# EAGLE design rev_B (EAGLE 9.5.0)
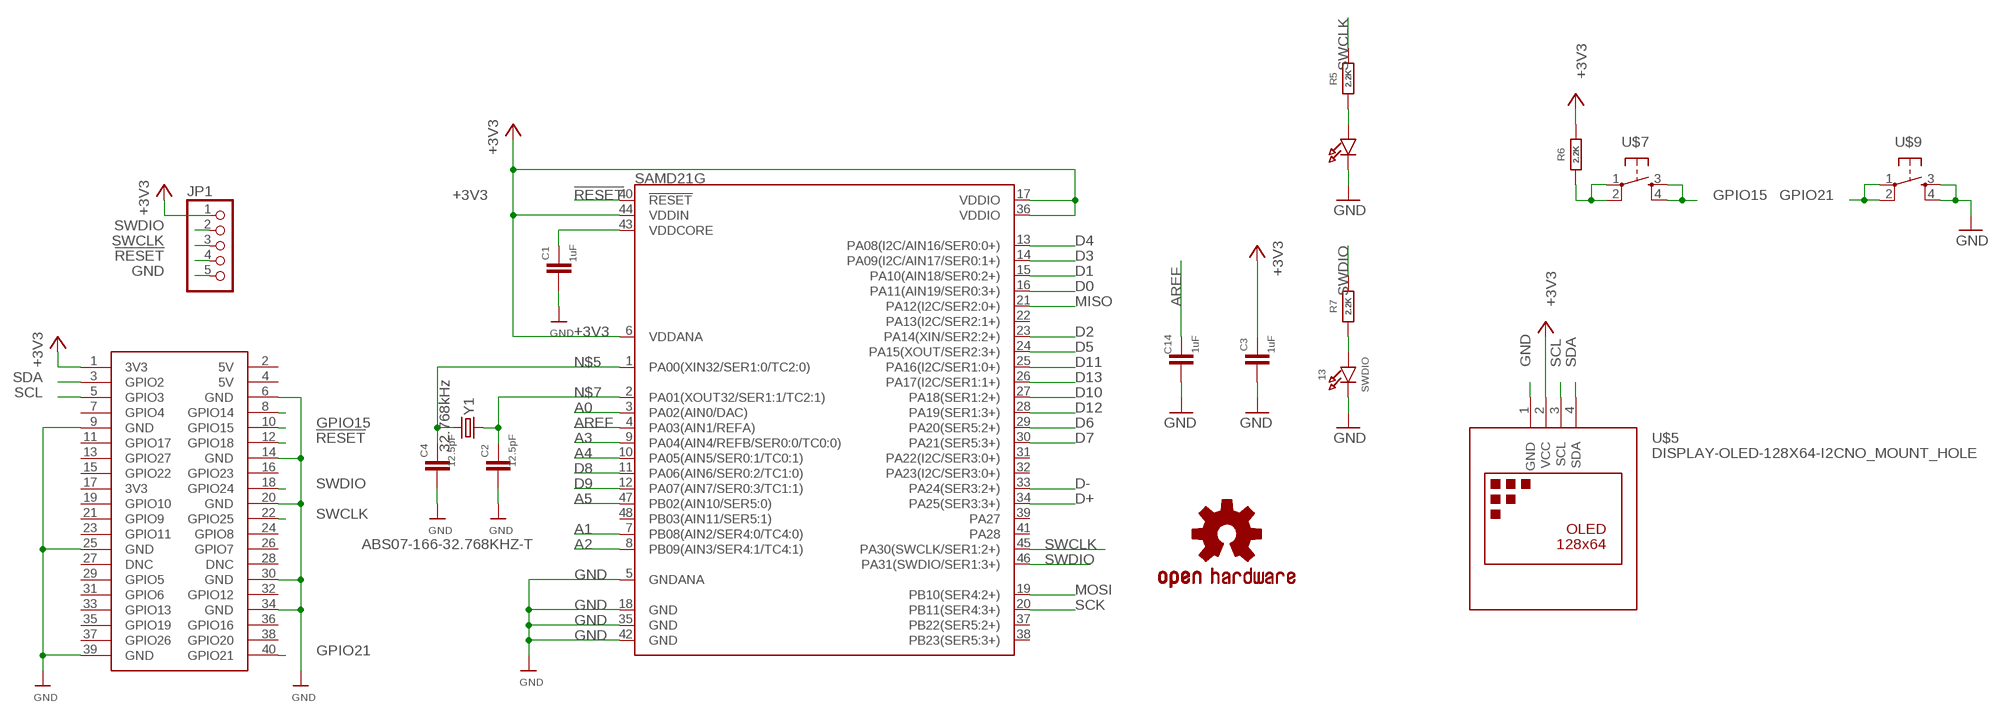
[diagram p0: schematic, sheet 1]

## Parts
5  SWCLK  LED0805_NOOUTLINE  [CHIPLED_0805_NOOUTLINE]
13  SWDIO  LED0805_NOOUTLINE  [CHIPLED_0805_NOOUTLINE]
C1  1uF  C-EUC0805  [C0805]
C2  12.5pF  C-EUC0805  [C0805]
C3  1uF  C-EUC0805  [C0805]
C4  12.5pF  C-EUC0805  [C0805]
C14  1uF  C-EUC0805  [C0805]
JP1  PINHD-1X5  [1X05]
LOGO1  OSHW-LOGOS  [OSHW-LOGO-S]
R5  2.2K  R-EU_R0805  [R0805]
R6  2.2K  R-EU_R0805  [R0805]
R7  2.2K  R-EU_R0805  [R0805]
SAMD21G  ATSAMD21G-A  [TQFP-48]
U$1  RASPBERRY_PI_ZERO  [RASPBERRY_PI_ZERO]
U$5  DISPLAY-OLED-128X64-I2CNO_MOUNT_HOLE  [DISPLAY-OLED-128X64-I2C]
U$7  TACTILE_SWITCH_LONG_THT_  [TACTILE_SWICTH_THT]
U$9  TACTILE_SWITCH_LONG_THT_  [TACTILE_SWICTH_THT]
Y1  32.768kHz  CRYSTAL3.2X1.5MM  [CRYSTAL-SMD-3.2X1.5MM]

## Nets
!RESET: JP1.4 SAMD21G.40(!RESET!) U$1.12(GPIO18)
+3V3: C3.1 JP1.1 R6.1 SAMD21G.6(VDDANA) SAMD21G.17(VDDIO) SAMD21G.36(VDDIO) SAMD21G.44(VDDIN) U$1.1(3V3) U$5.2(VCC)
A0: SAMD21G.3(PA02(AIN0/DAC))
A1: SAMD21G.7(PB08(AIN2/SER4:0/TC4:0))
A2: SAMD21G.8(PB09(AIN3/SER4:1/TC4:1))
A3: SAMD21G.9(PA04(AIN4/REFB/SER0:0/TC0:0))
A4: SAMD21G.10(PA05(AIN5/SER0:1/TC0:1))
A5: SAMD21G.47(PB02(AIN10/SER5:0))
AREF: C14.1 SAMD21G.4(PA03(AIN1/REFA))
D0: SAMD21G.16(PA11(AIN19/SER0:3+))
D1: SAMD21G.15(PA10(AIN18/SER0:2+))
D2: SAMD21G.23(PA14(XIN/SER2:2+))
D3: SAMD21G.14(PA09(I2C/AIN17/SER0:1+))
D4: SAMD21G.13(PA08(I2C/AIN16/SER0:0+))
D5: SAMD21G.24(PA15(XOUT/SER2:3+))
D6: SAMD21G.29(PA20(SER5:2+))
D7: SAMD21G.30(PA21(SER5:3+))
D8: SAMD21G.11(PA06(AIN6/SER0:2/TC1:0))
D9: SAMD21G.12(PA07(AIN7/SER0:3/TC1:1))
D10: SAMD21G.27(PA18(SER1:2+))
D11: SAMD21G.25(PA16(I2C/SER1:0+))
D12: SAMD21G.28(PA19(SER1:3+))
D13: SAMD21G.26(PA17(I2C/SER1:1+))
D+: SAMD21G.34(PA25(SER3:3+))
D-: SAMD21G.33(PA24(SER3:2+))
GND: 5.C 13.C C1.2 C2.2 C3.2 C4.2 C14.2 JP1.5 SAMD21G.5(GNDANA) SAMD21G.18(GND) SAMD21G.35(GND) SAMD21G.42(GND) U$1.6(GND) U$1.9(GND) U$1.14(GND) U$1.20(GND) U$1.25(GND) U$1.30(GND) U$1.34(GND) U$1.39(GND) U$5.1(GND) U$9.3 U$9.4
GPIO15: U$1.10(GPIO15) U$7.3 U$7.4
GPIO21: U$1.40(GPIO21) U$9.1 U$9.2
MISO: SAMD21G.21(PA12(I2C/SER2:0+))
MOSI: SAMD21G.19(PB10(SER4:2+))
N$2: 13.A R7.2
N$5: C4.1 SAMD21G.1(PA00(XIN32/SER1:0/TC2:0)) Y1.P$2
N$6: 5.A R5.2
N$7: C2.1 SAMD21G.2(PA01(XOUT32/SER1:1/TC2:1)) Y1.P$1
N$9: R6.2 U$7.1 U$7.2
N$16: U$1.8(GPIO14)
SCK: SAMD21G.20(PB11(SER4:3+))
SCL: U$1.5(GPIO3) U$5.3(SCL)
SDA: U$1.3(GPIO2) U$5.4(SDA)
SWCLK: JP1.3 R5.1 SAMD21G.45(PA30(SWCLK/SER1:2+)) U$1.22(GPIO25)
SWDIO: JP1.2 R7.1 SAMD21G.46(PA31(SWDIO/SER1:3+)) U$1.18(GPIO24)
VDDCORE: C1.1 SAMD21G.43(VDDCORE)
Unconnected: SAMD21G.22(PA13(I2C/SER2:1+)) SAMD21G.31(PA22(I2C/SER3:0+)) SAMD21G.32(PA23(I2C/SER3:0+)) SAMD21G.37(PB22(SER5:2+)) SAMD21G.38(PB23(SER5:3+)) SAMD21G.39(PA27) SAMD21G.41(PA28) SAMD21G.48(PB03(AIN11/SER5:1)) U$1.2(5V) U$1.4(5V) U$1.7(GPIO4) U$1.11(GPIO17) U$1.13(GPIO27) U$1.15(GPIO22) U$1.16(GPIO23) U$1.17(3V3) U$1.19(GPIO10) U$1.21(GPIO9) U$1.23(GPIO11) U$1.24(GPIO8) U$1.26(GPIO7) U$1.27(DNC) U$1.28(DNC) U$1.29(GPIO5) U$1.31(GPIO6) U$1.32(GPIO12) U$1.33(GPIO13) U$1.35(GPIO19) U$1.36(GPIO16) U$1.37(GPIO26) U$1.38(GPIO20)

## Notes on the sheet
- ABS07-166-32.768KHZ-T

## Library data of the parts
5 13 = microbuilder:LED: LED 0603 - 0603 Surface Mount Package 2mA: Green LED - Low Power (3.9mcd, 2ma, 1.7Vf) - Digikey: 475-2709-2-ND Orange LED - Low Power (9.8mcd, 2ma, 1.8Vf) - Digikey: 475-1194-2-ND Red LED - Low Power (5mcd, 2ma, 1.8Vf) - Digikey: 475-1195-2-ND Yellow LED - Low Power (7mcd, 2ma, 1.8Vf) - Digikey: 475-1196-2-ND 5mA: Blue LED - Low Power (17mcd, 5ma, 2.9Vf) - Digikey: LNJ937W8CRACT-ND 0805 - 0805 Surface Mount Package 2mA: Red LED (8.8mcd, 2mA, 1.8Vf, Clear) - Low Power [Digikey: 475-2510-1-ND] Green LED (5mcd, 2mA, 1.8Vf, Clear) - Low Power [Digikey: 475-2730-1-ND] Yellow LED (11.3mcd, 2mA, 1.8Vf, Clear) - Low Power [Digikey: 475-2555-1-ND] 20mA: Red LED (104mcd, 20mA, Diffused) - LS R976 [Digikey: 475-1278-6-ND] Red LED (12mcd, 20mA, 2.0Vf, Clear) - APT2012EC [Digikey: 754-1128-1-ND] Green LED (15mcd, 20mA, 2.2Vf, Clear) - APT2012GC [Digikey: 754-1131-1-ND] Orange LED (160mcd, 20mA, 2.1Vf, Clear) - APT2012SECK [Digikey: 754-1130-1-ND] 1206 - 1206 Surface Mount Package Green LED (26mcd, 20mA, Diffused) - LG N971 [Digikey: 475-1407-6-ND] Red LED (15mcd, 20mA, Diffused) - LH N974 [Digikey: 475-1416-6-ND] Cree - Cree High-Power Surface Mount LEDs XPEBWT-L1-0000-00D50 - White 111lm 350mA 2.9Vf 6200K 110° XTEAWT-00-0000-00000LEE3 - White 114lm 350mA 2.85Vf 5000K 115° Everlight - Everlight 45-21 Series Surface Mount LEDs 45-21/QK2C-B2832AC2CB2/2T - Warm White 2000mcd 20mA 3.25Vf 3050K 120° 45-21/LK2C-B38452C4CB2/2T - Nuetral White 2000mcd 20mA 3.25Vf 4150K 120° 45-21/LK2C-B50634C6CB2/2T - Cold White 2200mcd 20mA 3.25Vf 5650K 120° PLCC2 Reverse Mount LS T77K-J1L2-1-0-2-R18-Z - Red 11.25mcd 2mA 1.8Vf 630nm 120° LO T77K-L1M2-24-Z - Orange 19.6mcd 2mA 1.8Vf 606nm 120° LY T77K-K2M1-26-Z - Yellow 15.7mcd 2mA 1.8Vf 587nm 120°
C1-C4 C14 = rcl:C-EU: CAPACITOR, European symbol; SPICEPREFIX: C
JP1 = pinhead:PINHD-1X5: PIN HEADER
LOGO1 = SparkFun-Aesthetics:OSHW-LOGO: Open-Source Hardware (OSHW) Logo This logo indicates the piece of hardware it is found on incorporates a OSHW license and/or adheres to the definition of open source hardware found here: http://freedomdefined.org/OSHW
R5-R7 = rcl:R-EU_: RESISTOR, European symbol; SPICEPREFIX: R
SAMD21G = SparkFun-IC-Microcontroller:ATSAMD21G: Atmel SAMD21G SMART ARM-Based Microcontroller The Atmel ® | SMART ™ SAM D21 is a series of low-power microcontrollers using the 32-bit ARM ® Cortex ® -M0+ processor, and ranging from 32- to 64-pins with up to 256KB Flash and 32KB of SRAM. The SAM D21 devices operate at a maximum frequency of 48MHz and reach 2.46 CoreMark/MHz. They are designed for simple and intuitive migration with identical peripheral modules, hex compatible code, identical linear address map and pin compatible migration paths between all devices in the product series. All devices include intelligent and flexible peripherals, Atmel Event System for inter-peripheral signaling, and support for capacitive touch button, slider and wheel user interfaces. Datasheet <https://cdn.sparkfun.com/datasheets/Dev/Arduino/Boards/Atmel-42181-SAM-D21_Datasheet.pdf> SparkFun Products SparkFun SAMD21 Mini Breakout <https://www.sparkfun.com/products/13664> (DEV-13664) SparkFun SAMD21 Dev Breakout <https://www.sparkfun.com/products/13672> (DEV-13672); PROD_ID: IC-13064
U$1 = Wood Stand iRadio_rev_A1:RASPBERRY_PI_ZERO
U$5 = dronecz:DISPLAY-OLED-128X64-I2C: 128x64 Dot Matrix OLED Module based on SSD1306 chip Variant with I2C interface More details available here: http://www.instructables.com/id/Monochrome-096-i2c-OLED-display-with-arduino-SSD13/ SSD1306 datasheet: https://cdn-shop.adafruit.com/datasheets/SSD1306.pdf Click here to find device on ebay.com <http://www.ebay.com/sch/oled+display+128x64+iic> Note: There are two variants: I2C and SPI. Search for the proper version.
U$7 U$9 = dronecz:TACTILE_SWITCH_LONG_THT
Y1 = samd21-temp:CRYSTAL: Various standard crystals. Proven footprints.; PROD_ID: XTAL-13062

## Net classes
0 default: width 0.203 mm, drill 0.406 mm, clearance 0.203 mm

## Board
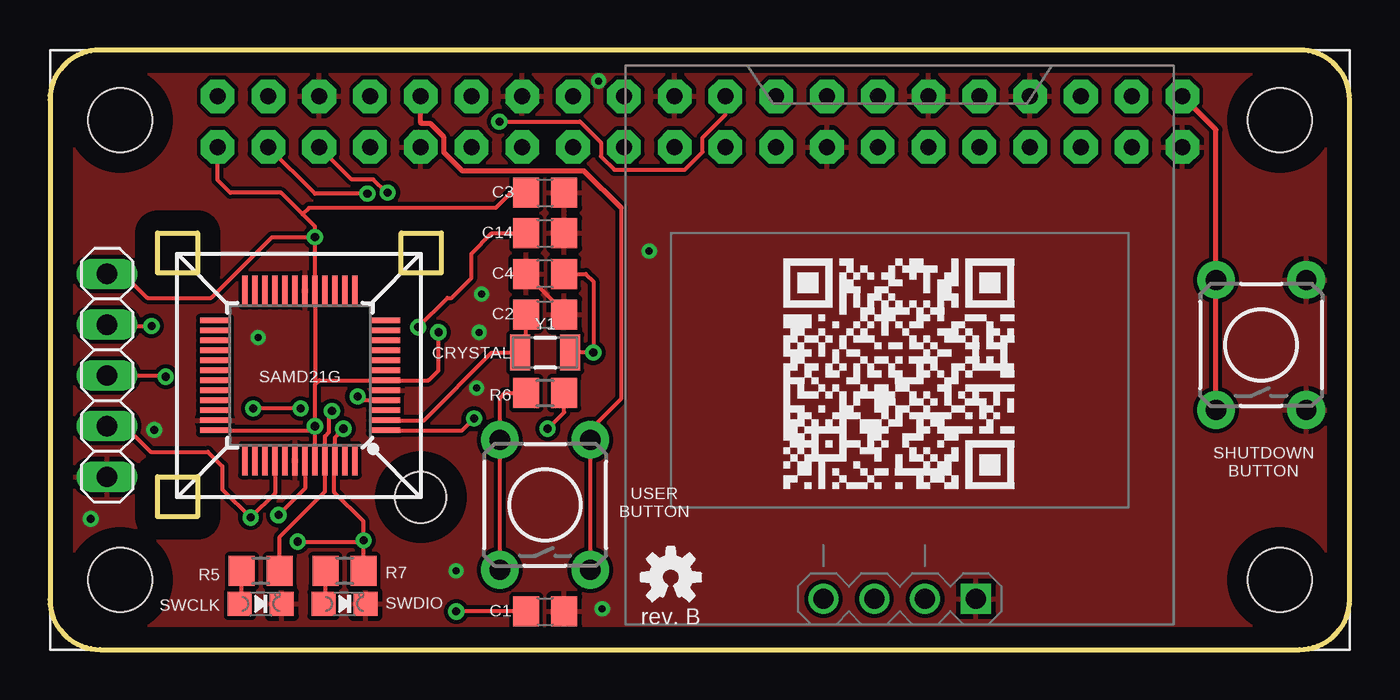
[diagram p1: board, top side]
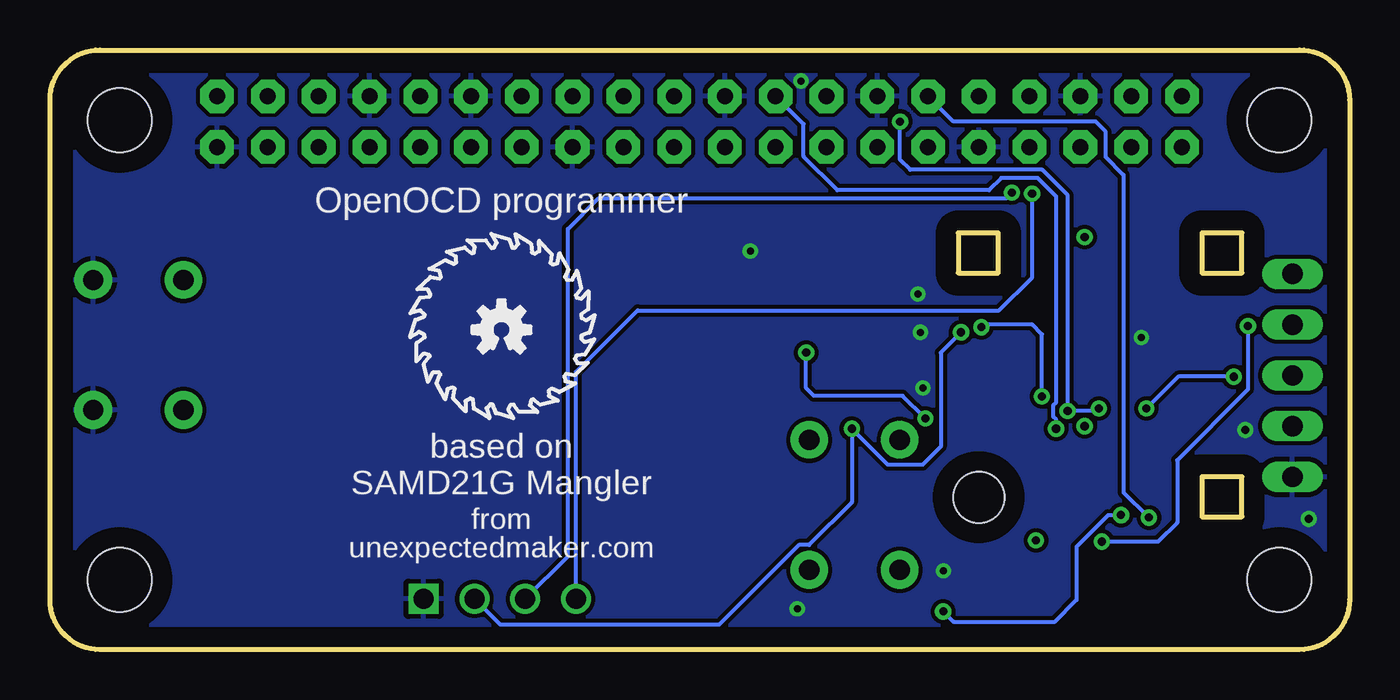
[diagram p2: board, bottom side, seen from below]

Size 65 x 30 mm. Coordinates in mm from the lower left corner, seen from the top.
Outline: 2.5,30 arc90 0,27.5 0,2.5 arc90 2.5,0 62.5,0 arc90 65,2.5 65,27.5 arc90 62.5,30 2.5,30
Outline: 7.38,8.65 7.38,6.65 5.38,6.65 5.38,8.65 7.38,8.65
Outline: 19.57,20.84 19.57,18.84 17.57,18.84 17.57,20.84 19.57,20.84
Outline: 5.38,20.84 7.38,20.84 7.38,18.84 5.38,18.84 5.38,20.84
Copper layers (1*16): Top 0.035mm / dielectric 1.5mm / Bottom 0.035mm
Design rules "default": minimum track width 6mil, minimum drill 0.35mm, track to track 6mil, track to pad 6mil, pad to pad 6mil, via to via 6mil, smd to smd 6mil, copper to edge 40mil, drill to drill 6mil, minimum pad ring 10mil, minimum via ring 8mil, stop-mask expansion 4mil, vias tented up to drill 0mil, thermal gap 10mil
Holes 2.54 mm at 18.54,7.62

### Footprints (pad centres in the part's own frame; a part is rotated, then mirrored left to right if it is on the bottom)
CHIPLED_0805_NOOUTLINE = smd 1.2 x 1.2: A 0,-1.05; C 0,1.05
C0805 = smd 1.3 x 1.5: 1 -0.95,0; 2 0.95,0
1X05 = drill 1.016 long: 1 -5.08,0; 2 -2.54,0; 3 0,0; 4 2.54,0; 5 5.08,0
R0805 = smd 1.3 x 1.5: 1 -0.95,0; 2 0.95,0
TQFP-48 = smd 1.5 x 0.28: 1 -4.25,2.75; 2 -4.25,2.25; 3 -4.25,1.75; 4 -4.25,1.25; 5 -4.25,0.75; 6 -4.25,0.25; 7 -4.25,-0.25; 8 -4.25,-0.75; 9 -4.25,-1.25; 10 -4.25,-1.75; 11 -4.25,-2.25; 12 -4.25,-2.75; 25 4.25,-2.75; 26 4.25,-2.25; 27 4.25,-1.75; 28 4.25,-1.25; 29 4.25,-0.75; 30 4.25,-0.25; 31 4.25,0.25; 32 4.25,0.75; 33 4.25,1.25; 34 4.25,1.75; 35 4.25,2.25; 36 4.25,2.75 | smd 0.28 x 1.5: 13 -2.75,-4.25; 14 -2.25,-4.25; 15 -1.75,-4.25; 16 -1.25,-4.25; 17 -0.75,-4.25; 18 -0.25,-4.25; 19 0.25,-4.25; 20 0.75,-4.25; 21 1.25,-4.25; 22 1.75,-4.25; 23 2.25,-4.25; 24 2.75,-4.25; 37 2.75,4.25; 38 2.25,4.25; 39 1.75,4.25; 40 1.25,4.25; 41 0.75,4.25; 42 0.25,4.25; 43 -0.25,4.25; 44 -0.75,4.25; 45 -1.25,4.25; 46 -1.75,4.25; 47 -2.25,4.25; 48 -2.75,4.25
RASPBERRY_PI_ZERO = drill 0.8 pad 1.676 octagon: 1 -24.13,11.43; 2 -24.13,13.97; 3 -21.59,11.43; 4 -21.59,13.97; 5 -19.05,11.43; 6 -19.05,13.97; 7 -16.51,11.43; 8 -16.51,13.97; 9 -13.97,11.43; 10 -13.97,13.97; 11 -11.43,11.43; 12 -11.43,13.97; 13 -8.89,11.43; 14 -8.89,13.97; 15 -6.35,11.43; 16 -6.35,13.97; 17 -3.81,11.43; 18 -3.81,13.97; 19 -1.27,11.43; 20 -1.27,13.97; 21 1.27,11.43; 22 1.27,13.97; 23 3.81,11.43; 24 3.81,13.97; 25 6.35,11.43; 26 6.35,13.97; 27 8.89,11.43; 28 8.89,13.97; 29 11.43,11.43; 30 11.43,13.97; 31 13.97,11.43; 32 13.97,13.97; 33 16.51,11.43; 34 16.51,13.97; 35 19.05,11.43; 36 19.05,13.97; 37 21.59,11.43; 38 21.59,13.97; 39 24.13,11.43; 40 24.13,13.97 | hole 3.2: -29,12.77; -29,-10.23; 29,-10.23; 29,12.77
DISPLAY-OLED-128X64-I2C = drill 1 square: 1 -3.81,12.7 | drill 1: 2 -1.27,12.7; 3 1.27,12.7; 4 3.81,12.7
TACTILE_SWICTH_THT = drill 1.016 pad 1.88: 1 -3.251,2.261; 2 3.251,2.261; 3 -3.251,-2.261; 4 3.251,-2.261
CRYSTAL-SMD-3.2X1.5MM = smd 1 x 1.8: P$1 -1.25,0; P$2 1.25,0

### Placement (x,y rotation side)
5  10.54,2.29 270 top
13  14.73,2.29 270 top
C1  24.77,1.91 0 top
C2  24.77,16.76 0 top
C3  24.77,22.86 0 top
C4  24.77,18.8 180 top
C14  24.77,20.83 0 top
JP1  2.86,13.72 270 top
LOGO1  31.05,3.62 0 top
LOGO2  OSHW-LOGOS  [OSHW-LOGO-S]  42.42,16 0 bottom
R5  10.54,3.94 180 top
R6  24.77,12.83 180 top
R7  14.73,3.94 180 top
SAMD21G  12.5,13.72 180 top
U$1  32.51,13.72 0 top
U$5  42.5,15.24 180 top
U$7  24.77,7.24 90 top
U$9  60.58,15.24 90 top
Y1  24.77,14.86 0 top

### Tracks (layer width: path | path; a pad name or v marks a point on that pad's centre or on a via)
!RESET  (via drill 0.41)
  Top 0.203: SAMD21G.40 11.25,7.82 v10.03,6.6 8.62,8.01 8.62,9.17 7.9,9.89 5.03,9.89 3.75,11.18 JP1.4
  Bottom 0.203: v10.03,6.6 11.3,7.87 11.3,23.75 12.19,24.64 12.19,25.91 12.7,26.42 19.81,26.42 U$1.12
+3V3  (via drill 0.41)
  Top 0.203: SAMD21G.44 v13.25,11.18 | v13.25,11.18 13.25,13.25 13.34,13.34 | 13.34,13.34 13.47,13.47 SAMD21G.6 18.93,13.47 19.43,13.97 v19.43,15.88 | SAMD21G.36 13.04,10.97 v13.25,11.18 | 13.34,13.34 13.25,13.42 SAMD21G.17 v13.25,20.64 | v24.89,11.05 25.71,11.87 R6.1 | v13.25,20.64 13.25,21.17 12.64,21.78 | 12.64,21.78 11.56,22.86 9.02,22.86 8.38,23.5 U$1.1 | C3.1 23.05,22.86 22.29,22.1 12.95,22.1 12.64,21.78 | v13.25,20.64 11.1,20.64 8.06,17.6 4.86,17.6 3.67,18.8 JP1.1
  Bottom 0.203: U$5.2 42.48,1.25 31.53,1.25 27.54,5.23 27.03,5.23 24.89,7.37 v24.89,11.05 23.09,9.25 21.36,9.25 20.45,10.16 20.45,14.86 v19.43,15.88
AREF  (via drill 0.41)
  Top 0.203: SAMD21G.4 15.58,12.47 v15.38,12.66 | v18.41,16.13 19.88,17.6 20.09,17.6 21.08,18.59 21.08,19.81 22.1,20.83 C14.1
  Bottom 0.203: v15.38,12.66 15.38,15.77 15.88,16.26 18.29,16.26 v18.41,16.13
GND  (via drill 0.35, 0.41)
  Top 0.203: C4.2 25.71,16.9 C2.2
  other vias: 2.03,6.54 21.34,13.08 21.46,15.88 10.41,15.62 29.97,19.94 27.43,28.45 21.59,17.78 20.32,3.94 5.21,10.99 27.62,2.03
  pour Top: 0,0 65.02,0 65.02,29.97 0,29.97
  pour Bottom: 0,0 65.02,0 65.02,29.97 0,29.97
GPIO15
  Top 0.203: U$7.3 U$7.4 27.03,11.02 28.57,12.57 28.57,22.1
  Top 0.254: 28.57,22.1 26.72,23.95 20.63,23.95 19.71,24.86 19.71,25.63 19.03,26.31 18.59,26.31 18.54,26.36 U$1.10
GPIO21
  Top 0.254: U$9.1 U$9.2 58.32,26.01 U$1.40
N$2
  Top 0.203: 13.A 13.78,2.39 R7.2
N$5  (via drill 0.41)
  Top 0.203: SAMD21G.1 20.62,10.97 v21.21,11.56 | Y1.P$2 v27.18,14.86 27.18,18.41 26.8,18.8 C4.1
  Bottom 0.203: v21.21,11.56 22.35,12.7 26.8,12.7 27.18,13.08 v27.18,14.86
N$6
  Top 0.203: 5.A 9.59,2.39 R5.2
N$7
  Top 0.203: SAMD21G.2 18.7,11.47 22.1,14.86 Y1.P$1 23.82,15.16 C2.1
N$9
  Top 0.203: U$7.1 U$7.2 22.5,12.6 22.73,12.83 R6.2
SCL  (via drill 0.41)
  Top 0.203: v16.89,22.86 16.83,22.86 16.17,23.52 15.24,23.52 15.09,23.52 U$1.5
  Bottom 0.203: U$5.3 39.1,4.67 39.1,21.04 37.56,22.58 17.17,22.58 v16.89,22.86
SDA  (via drill 0.41)
  Top 0.203: v15.88,22.81 13.26,22.81 U$1.3
  Bottom 0.203: U$5.4 38.69,13.89 35.61,16.97 17.53,16.97 15.88,18.62 v15.88,22.81
SWCLK  (via drill 0.41)
  Top 0.203: R5.1 11.49,5.65 13.75,7.91 SAMD21G.45 13.75,10.67 13.96,10.88 13.96,11.8 v14.1,11.94 | v22.48,26.42 26.51,26.42 27.56,25.36 27.56,24.67 28.23,24 31.75,24 32.64,24.89 32.64,25.62 33.78,26.76 U$1.22 | JP1.3 5.73,13.72 v5.79,13.65 | v12.54,12.06 v10.16,12.06
  Bottom 0.203: v22.48,26.42 22.48,24.51 21.97,24 15.37,24 14.1,22.73 v14.1,11.94 12.67,11.94 v12.54,12.06 | v5.79,13.65 8.57,13.65 v10.16,12.06
SWDIO  (via drill 0.41)
  Top 0.203: R7.1 v15.68,5.46 | v15.68,5.46 15.68,6.42 14.22,7.87 14.22,9.44 SAMD21G.46 14.25,10.6 14.37,10.71 14.37,10.74 v14.67,11.05 | JP1.2 2.92,16.19 v5.08,16.19 | v12.38,5.4 15.62,5.4 v15.68,5.46
  Bottom 0.203: v14.67,11.05 14.67,11.51 14.81,11.64 14.81,12.23 14.67,12.37 14.67,22.67 15.6,23.6 17.42,23.6 18.03,22.99 25.62,22.99 27.3,24.67 27.3,26.29 U$1.18 | v5.08,16.19 5.08,13.02 8.62,9.47 8.62,6.35 9.58,5.4 v12.38,5.4
VDDCORE  (via drill 0.41)
  Top 0.203: C1.1 v20.32,1.91 | SAMD21G.43 12.75,8.05 v11.43,6.73
  Bottom 0.203: v20.32,1.91 19.81,1.4 14.73,1.4 13.65,2.48 13.65,5.14 12.06,6.73 v11.43,6.73

### Text on the board
bPlace: OpenOCD programmer | based on / SAMD21G Mangler | from / unexpectedmaker.com
tNames: CRYSTAL | SHUTDOWN / BUTTON | USER / BUTTON | SWCLK | SWDIO | rev. B